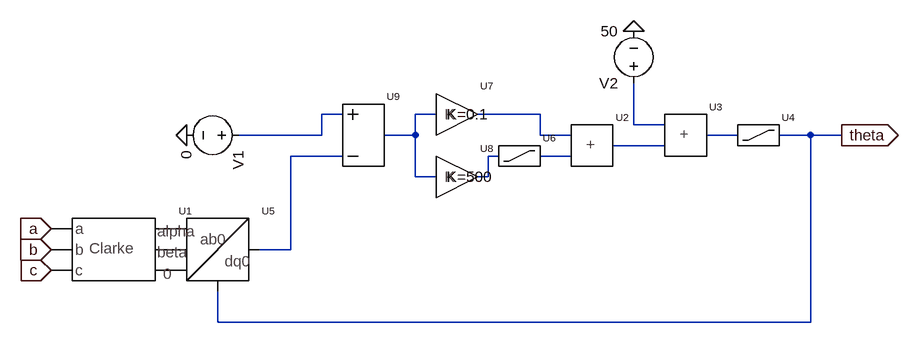
[diagram p0: schematic PLL.asc]
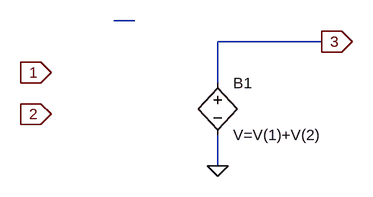
[diagram p1: sub-circuit adder.asc]
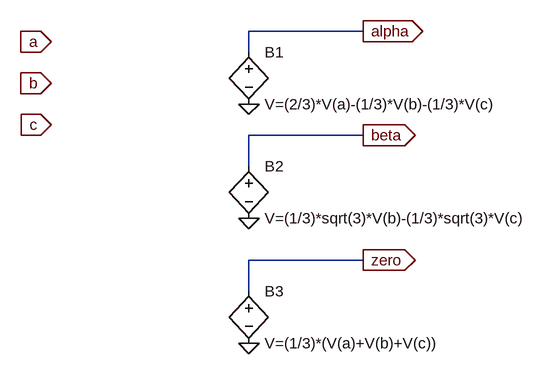
[diagram p2: sub-circuit clarke.asc]
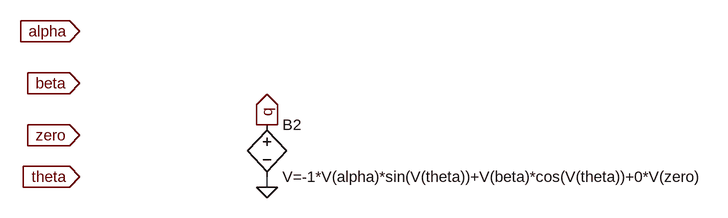
[diagram p3: sub-circuit alphabeta-dq.asc]
PLL.asc, the LTspice schematic file:
Version 4
SHEET 1 1272 680
WIRE 384 -32 352 -32
WIRE 528 -32 496 -32
WIRE 688 -32 592 -32
WIRE 832 -16 832 -80
WIRE 880 -16 832 -16
WIRE 352 0 352 -32
WIRE 352 0 224 0
WIRE 496 0 496 -32
WIRE 496 0 448 0
WIRE 688 0 688 -32
WIRE 736 0 688 0
WIRE 992 0 944 0
WIRE 1104 0 1056 0
WIRE 1152 0 1104 0
WIRE 880 16 800 16
WIRE 384 32 304 32
WIRE 624 32 608 32
WIRE 736 32 688 32
WIRE 496 64 496 0
WIRE 528 64 496 64
WIRE 608 64 608 32
WIRE 608 64 592 64
WIRE 304 176 304 32
WIRE 304 176 256 176
WIRE 192 288 192 240
WIRE 1104 288 1104 0
WIRE 1104 288 192 288
FLAG 144 0 0
FLAG 832 -160 0
FLAG 1152 0 theta
IOPIN 1152 0 Out
FLAG -64 176 b
IOPIN -64 176 In
FLAG -64 144 a
IOPIN -64 144 In
FLAG -64 208 c
IOPIN -64 208 In
SYMBOL voltage 240 0 R90
WINDOW 123 0 0 Left 0
WINDOW 39 0 0 Left 0
SYMATTR InstName V1
SYMATTR Value 0
SYMBOL adder 912 0 R0
SYMATTR InstName U3
SYMBOL voltage 832 -64 R180
WINDOW 123 0 0 Left 0
WINDOW 39 0 0 Left 0
SYMATTR InstName V2
SYMATTR Value 50
SYMBOL integral 1024 0 R0
SYMATTR InstName U4
SYMBOL clarke 32 176 R0
SYMATTR InstName U1
SYMBOL alphabeta-dq 192 176 R0
SYMATTR InstName U5
SYMBOL adder 768 16 R0
SYMATTR InstName U2
SYMBOL integral 656 32 R0
SYMATTR InstName U6
SYMBOL gain 544 -32 R0
WINDOW 3 0 0 Left 0
SYMATTR Value K=0.1
SYMATTR InstName U7
SYMBOL gain 544 64 R0
WINDOW 3 0 0 Left 0
SYMATTR Value K=500
SYMATTR InstName U8
SYMBOL subtractor 400 -32 R0
SYMATTR InstName U9

adder.asc, the sub-circuit schematic file:
Version 4
SHEET 1 880 680
WIRE 80 48 48 48
WIRE 368 80 208 80
WIRE 208 144 208 80
WIRE 208 272 208 224
FLAG -48 128 1
IOPIN -48 128 In
FLAG -48 192 2
IOPIN -48 192 In
FLAG 208 272 0
FLAG 368 80 3
IOPIN 368 80 Out
SYMBOL bv 208 128 R0
SYMATTR InstName B1
SYMATTR Value V=V(1)+V(2)

clarke.asc, the sub-circuit schematic file:
Version 4
SHEET 1 880 680
WIRE 512 112 336 112
WIRE 336 144 336 112
WIRE 512 272 336 272
WIRE 336 320 336 272
WIRE 512 464 336 464
WIRE 336 512 336 464
FLAG 32 128 a
IOPIN 32 128 In
FLAG 32 192 b
IOPIN 32 192 In
FLAG 32 256 c
IOPIN 32 256 In
FLAG 336 224 0
FLAG 336 400 0
FLAG 512 112 alpha
IOPIN 512 112 Out
FLAG 512 272 beta
IOPIN 512 272 Out
FLAG 336 592 0
FLAG 512 464 zero
IOPIN 512 464 Out
SYMBOL bv 336 128 R0
SYMATTR InstName B1
SYMATTR Value V=(2/3)*V(a)-(1/3)*V(b)-(1/3)*V(c)
SYMBOL bv 336 304 R0
SYMATTR InstName B2
SYMATTR Value V=(1/3)*sqrt(3)*V(b)-(1/3)*sqrt(3)*V(c)
SYMBOL bv 336 496 R0
SYMATTR InstName B3
SYMATTR Value V=(1/3)*(V(a)+V(b)+V(c))

alphabeta-dq.asc, the sub-circuit schematic file:
Version 4
SHEET 1 1192 680
WIRE 416 368 416 352
FLAG 128 128 alpha
IOPIN 128 128 In
FLAG 128 208 beta
IOPIN 128 208 In
FLAG 128 288 zero
IOPIN 128 288 In
FLAG 128 352 theta
IOPIN 128 352 In
FLAG 416 368 0
FLAG 416 272 q
IOPIN 416 272 Out
SYMBOL bv 416 256 R0
SYMATTR InstName B2
SYMATTR Value V=-1*V(alpha)*sin(V(theta))+V(beta)*cos(V(theta))+0*V(zero)

The netlist it stands for:
* PLL.asc
V1 N001 0 0
XU3 N004 N006 N005 adder
V2 N004 0 50
XU4 N005 theta integral  ; pins 1 2
XU1 a b c P001 P002 P003 clarke
XU5 P001 P002 P003 theta N007 alphabeta-dq
XU2 N003 N009 N006 adder
XU6 N008 N009 integral  ; pins 1 2
XU7 N002 N003 gain K=0.1  ; pins 1 2
XU8 N002 N008 gain K=500  ; pins 1 2
XU9 N001 N007 N002 subtract  ; pins 1 2 3

* block symbol definitions
.subckt adder 1 2 3
B1 3 0 V=V(1)+V(2)
.ends adder

.subckt clarke a b c alpha beta zero
B1 alpha 0 V=(2/3)*V(a)-(1/3)*V(b)-(1/3)*V(c)
B2 beta 0 V=(1/3)*sqrt(3)*V(b)-(1/3)*sqrt(3)*V(c)
B3 zero 0 V=(1/3)*(V(a)+V(b)+V(c))
.ends clarke

.subckt alphabeta-dq alpha beta zero theta q
B2 q 0 V=-1*V(alpha)*sin(V(theta))+V(beta)*cos(V(theta))+0*V(zero)
.ends alphabeta-dq

.lib adder.lib
.lib integral.lib
.lib clarke.lib
.lib alphabeta-dq.lib
.lib gain.lib
.lib subtractor.lib
.backanno
.end